# Altium schematic sheet BM1397_TESTBED.SchDoc
size A4; SheetNumber: 1; SheetTotal: 1
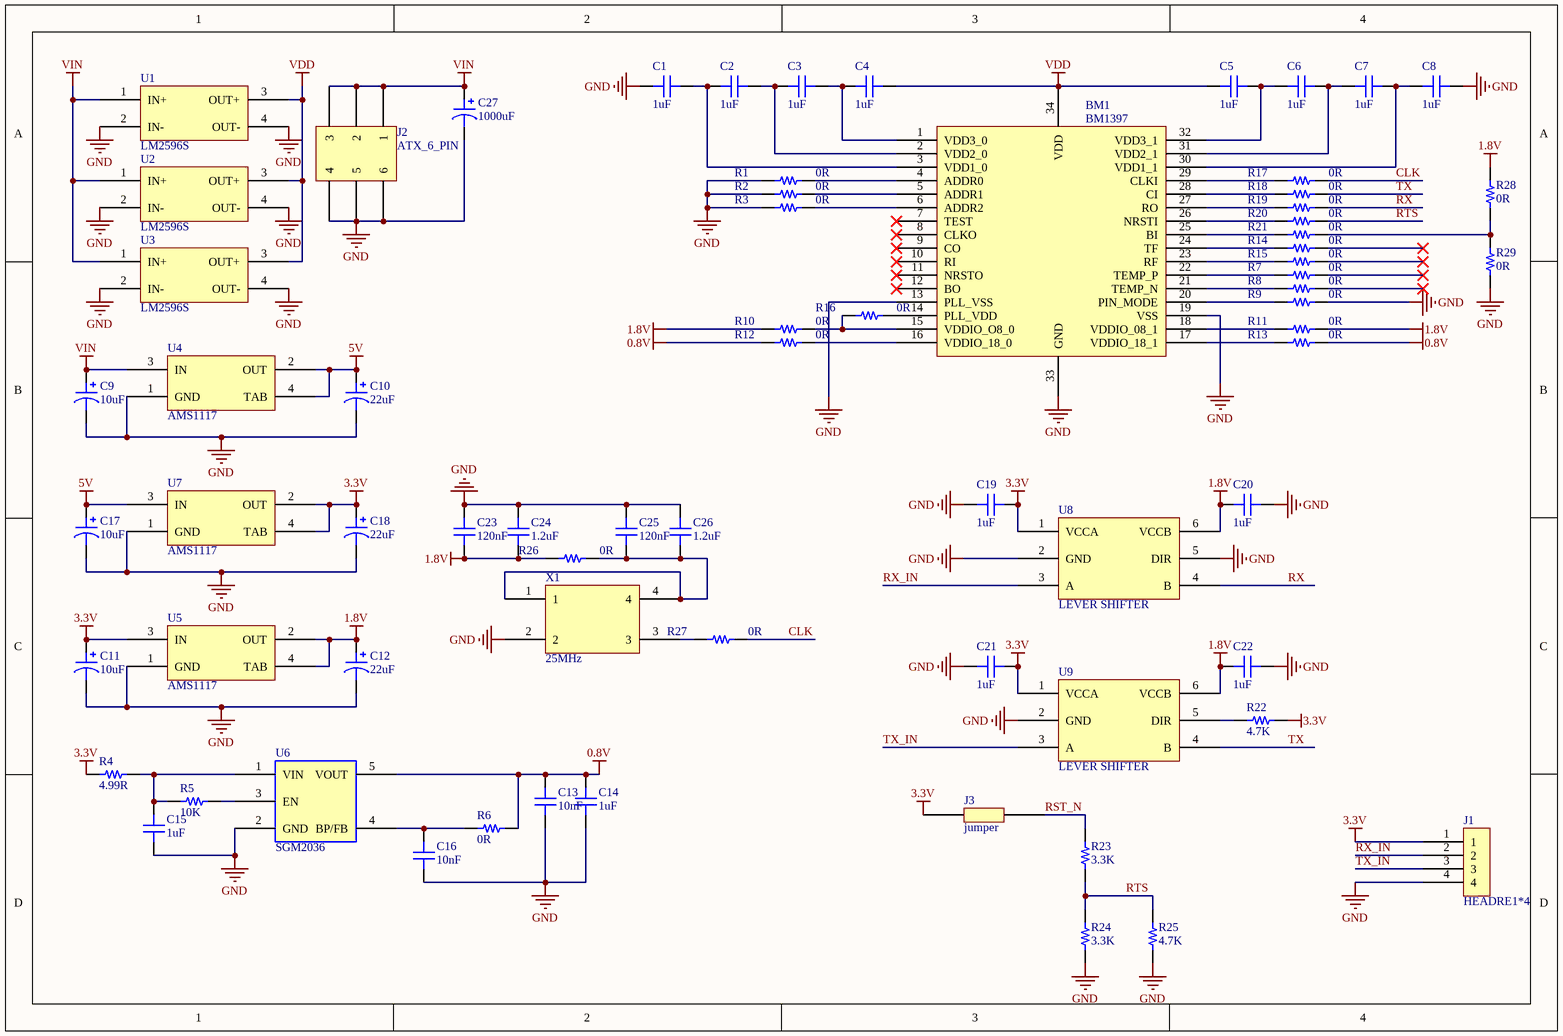
[diagram p0: BM1397_TESTBED.SchDoc]

## Parts
BM1  BM1397  [Connector]
C1  1uF  [CAP_SMD_0805]
C2  1uF  [CAP_SMD_0805]
C3  1uF  [CAP_SMD_0805]
C4  1uF  [CAP_SMD_0805]
C5  1uF  [CAP_SMD_0805]
C6  1uF  [CAP_SMD_0805]
C7  1uF  [CAP_SMD_0805]
C8  1uF  [CAP_SMD_0805]
C9  10uF  [CAP-TAN-CASE-B]
C10  22uF  [CAP-TAN-CASE-B]
C11  10uF  [CAP-TAN-CASE-B]
C12  22uF  [CAP-TAN-CASE-B]
C13  10nF  [CAP_SMD_0805]
C14  1uF  [CAP_SMD_0805]
C15  1uF  [CAP_SMD_0805]
C16  10nF  [CAP_SMD_0805]
C17  10uF  [CAP-TAN-CASE-B]
C18  22uF  [CAP-TAN-CASE-B]
C19  1uF  [CAP_SMD_0805]
C20  1uF  [CAP_SMD_0805]
C21  1uF  [CAP_SMD_0805]
C22  1uF  [CAP_SMD_0805]
C23  120nF  [CAP_SMD_1206]
C24  1.2uF  [CAP_SMD_1206]
C25  120nF  [CAP_SMD_1206]
C26  1.2uF  [CAP_SMD_1206]
C27  1000uF  [CAP_POL]
J1  HEADRE1*4  [HEADER-1x4]
J2  ATX_6_PIN  [ATX 6]
J3  jumper  [jumper_2pin]
R1  0R  [RES-SMD-1206]
R2  0R  [RES-SMD-1206]
R3  0R  [RES-SMD-1206]
R4  4.99R  [RES-SMD-1206]
R5  10K  [RES-SMD-1206]
R6  0R  [RES-SMD-1206]
R7  0R  [RES-SMD-1206]
R8  0R  [RES-SMD-1206]
R9  0R  [RES-SMD-1206]
R10  0R  [RES-SMD-1206]
R11  0R  [RES-SMD-1206]
R12  0R  [RES-SMD-1206]
R13  0R  [RES-SMD-1206]
R14  0R  [RES-SMD-1206]
R15  0R  [RES-SMD-1206]
R16  0R  [RES-SMD-1206]
R17  0R  [RES-SMD-1206]
R18  0R  [RES-SMD-1206]
R19  0R  [RES-SMD-1206]
R20  0R  [RES-SMD-1206]
R21  0R  [RES-SMD-1206]
R22  4.7K  [RES-SMD-1206]
R23  3.3K  [RES-SMD-1206]
R24  3.3K  [RES-SMD-1206]
R25  4.7K  [RES-SMD-1206]
R26  0R  [RES-SMD-1206]
R27  0R  [RES-SMD-1206]
R28  0R  [RES-SMD-1206]
R29  0R  [RES-SMD-1206]
U1  LM2596S  [LM2596S]
U2  LM2596S  [LM2596S]
U3  LM2596S  [LM2596S]
U4  AMS1117  [AMS1117]
U5  AMS1117  [AMS1117]
U6  SGM2036  [SOT23-5PIN]
U7  AMS1117  [AMS1117]
U8  LEVER SHIFTER  [SOT23-6PIN]
U9  LEVER SHIFTER  [SOT23-6PIN]
X1  25MHz  [XTALL]

## Nets
0.8V: C13.2 C14.2 R6.2 R12.1 R13.2 U6.5(VOUT)
1.8V: C12.1 C20.1 C22.1 C23.1 C24.1 R10.1 R11.2 R26.1 R28.2 U5.2(OUT) U5.4(TAB) U8.6(VCCB) U9.6(VCCB)
3.3V: C11.1 C18.1 C19.2 C21.2 J1.1 J3.1 R4.1 R22.2 U5.3(IN) U7.2(OUT) U7.4(TAB) U8.1(VCCA) U9.1(VCCA)
5V: C10.1 C17.1 U4.2(OUT) U4.4(TAB) U7.3(IN)
GND: BM1.13(PLL_VSS) BM1.19(VSS) BM1.33(GND) C1.1 C8.2 C9.2 C10.2 C11.2 C12.2 C13.1 C14.1 C15.1 C16.1 C17.2 C18.2 C19.1 C20.2 C21.1 C22.2 C23.2 C24.2 C25.2 C26.2 C27.2 J1.4 J2.4 J2.5 J2.6 R1.1 R2.1 R3.1 R9.2 R24.1 R25.1 R29.1 U1.2(IN-) U1.4(OUT-) U2.2(IN-) U2.4(OUT-) U3.2(IN-) U3.4(OUT-) U4.1(GND) U5.1(GND) U6.2(GND) U7.1(GND) U8.2(GND) U8.5(DIR) U9.2(GND) X1.2
VDD: BM1.34(VDD) C4.2 C5.1 U1.3(OUT+) U2.3(OUT+) U3.3(OUT+)
VIN: C9.1 C27.1 J2.1 J2.2 J2.3 U1.1(IN+) U2.1(IN+) U3.1(IN+) U4.3(IN)
CLK: R17.2 R27.2
RST_N: J3.2 R23.2
RTS: R20.2 R23.1 R24.2 R25.2
RX: R19.2 U8.4(B)
RX_IN: J1.2 U8.3(A)
TX: R18.2 U9.4(B)
TX_IN: J1.3 U9.3(A)
NetBM1_1: BM1.1(VDD3_0) C3.2 C4.1
NetBM1_2: BM1.2(VDD2_0) C2.2 C3.1
NetBM1_3: BM1.3(VDD1_0) C1.2 C2.1
NetBM1_4: BM1.4(ADDR0) R1.2
NetBM1_5: BM1.5(ADDR1) R2.2
NetBM1_6: BM1.6(ADDR2) R3.2
NetBM1_14: BM1.14(PLL_VDD) R16.2
NetBM1_15: BM1.15(VDDIO_O8_0) R10.2 R16.1
NetBM1_16: BM1.16(VDDIO_18_0) R12.2
NetBM1_17: BM1.17(VDDIO_18_1) R13.1
NetBM1_18: BM1.18(VDDIO_08_1) R11.1
NetBM1_20: BM1.20(PIN_MODE) R9.1
NetBM1_21: BM1.21(TEMP_N) R8.1
NetBM1_22: BM1.22(TEMP_P) R7.1
NetBM1_23: BM1.23(RF) R15.1
NetBM1_24: BM1.24(TF) R14.1
NetBM1_25: BM1.25(BI) R21.1
NetBM1_26: BM1.26(NRSTI) R20.1
NetBM1_27: BM1.27(RO) R19.1
NetBM1_28: BM1.28(CI) R18.1
NetBM1_29: BM1.29(CLKI) R17.1
NetBM1_30: BM1.30(VDD1_1) C7.2 C8.1
NetBM1_31: BM1.31(VDD2_1) C6.2 C7.1
NetBM1_32: BM1.32(VDD3_1) C5.2 C6.1
NetC15_2: C15.2 R4.2 R5.1 U6.1(VIN)
NetC16_2: C16.2 R6.1 U6.4(BP/FB)
NetC25_1: C25.1 C26.1 R26.2 X1.1 X1.4
NetR5_2: R5.2 U6.3(EN)
NetR21_2: R21.2 R28.1 R29.2
NetR22_1: R22.1 U9.5(DIR)
NetR27_1: R27.1 X1.3

Not connected (* = marked no-connect by the designer): BM1 7(TEST)* 8(CLKO)* 9(CO)* 10(RI)* 11(NRSTO)* 12(BO)*; R7 2*; R8 2*; R14 2*; R15 2*

## Library data of the parts
BM1 = BM1397_0
C1-C8 C13-C16 C19-C26 = CAP
C9-C12 C17 C18 C27 = POLARIZED CAP
J1 = HEADER-1x4
J2 = ATX_6_PIN: ATX PWR CONN 6 PIN
J3 = Jumper_2
R1-R29 = RES
U1-U3 = LM2596s: DC-DC CONVERTER
U8 U9 = SN74LVC1T45
X1 = XTALL